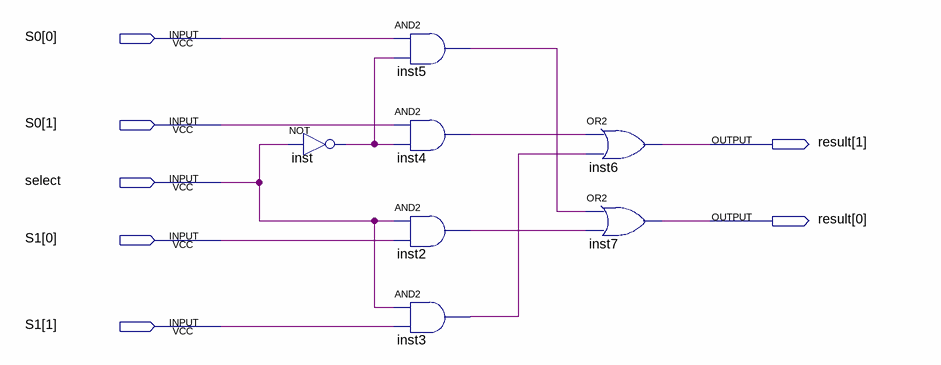
[diagram p0: schematic sheet]
// Quartus schematic mux2.bdf as structural Verilog: 7 symbols, 7 pins
module mux2 (
  input  [1:0] S0,
  input  select,
  input  [1:0] S1,
  output [1:0] result
);

  wire inst2_out, inst3_out, inst4_out, inst5_out, inst_out;

  not inst (inst_out, select);
  and inst5 (inst5_out, S0[0], inst_out);
  and inst4 (inst4_out, S0[1], inst_out);
  and inst2 (inst2_out, select, S1[0]);
  and inst3 (inst3_out, select, S1[1]);
  or inst6 (result[1], inst4_out, inst3_out);
  or inst7 (result[0], inst5_out, inst2_out);
endmodule
